# EAGLE design mainboard-augmented-thermostat-v1 (EAGLE 7.5.0)
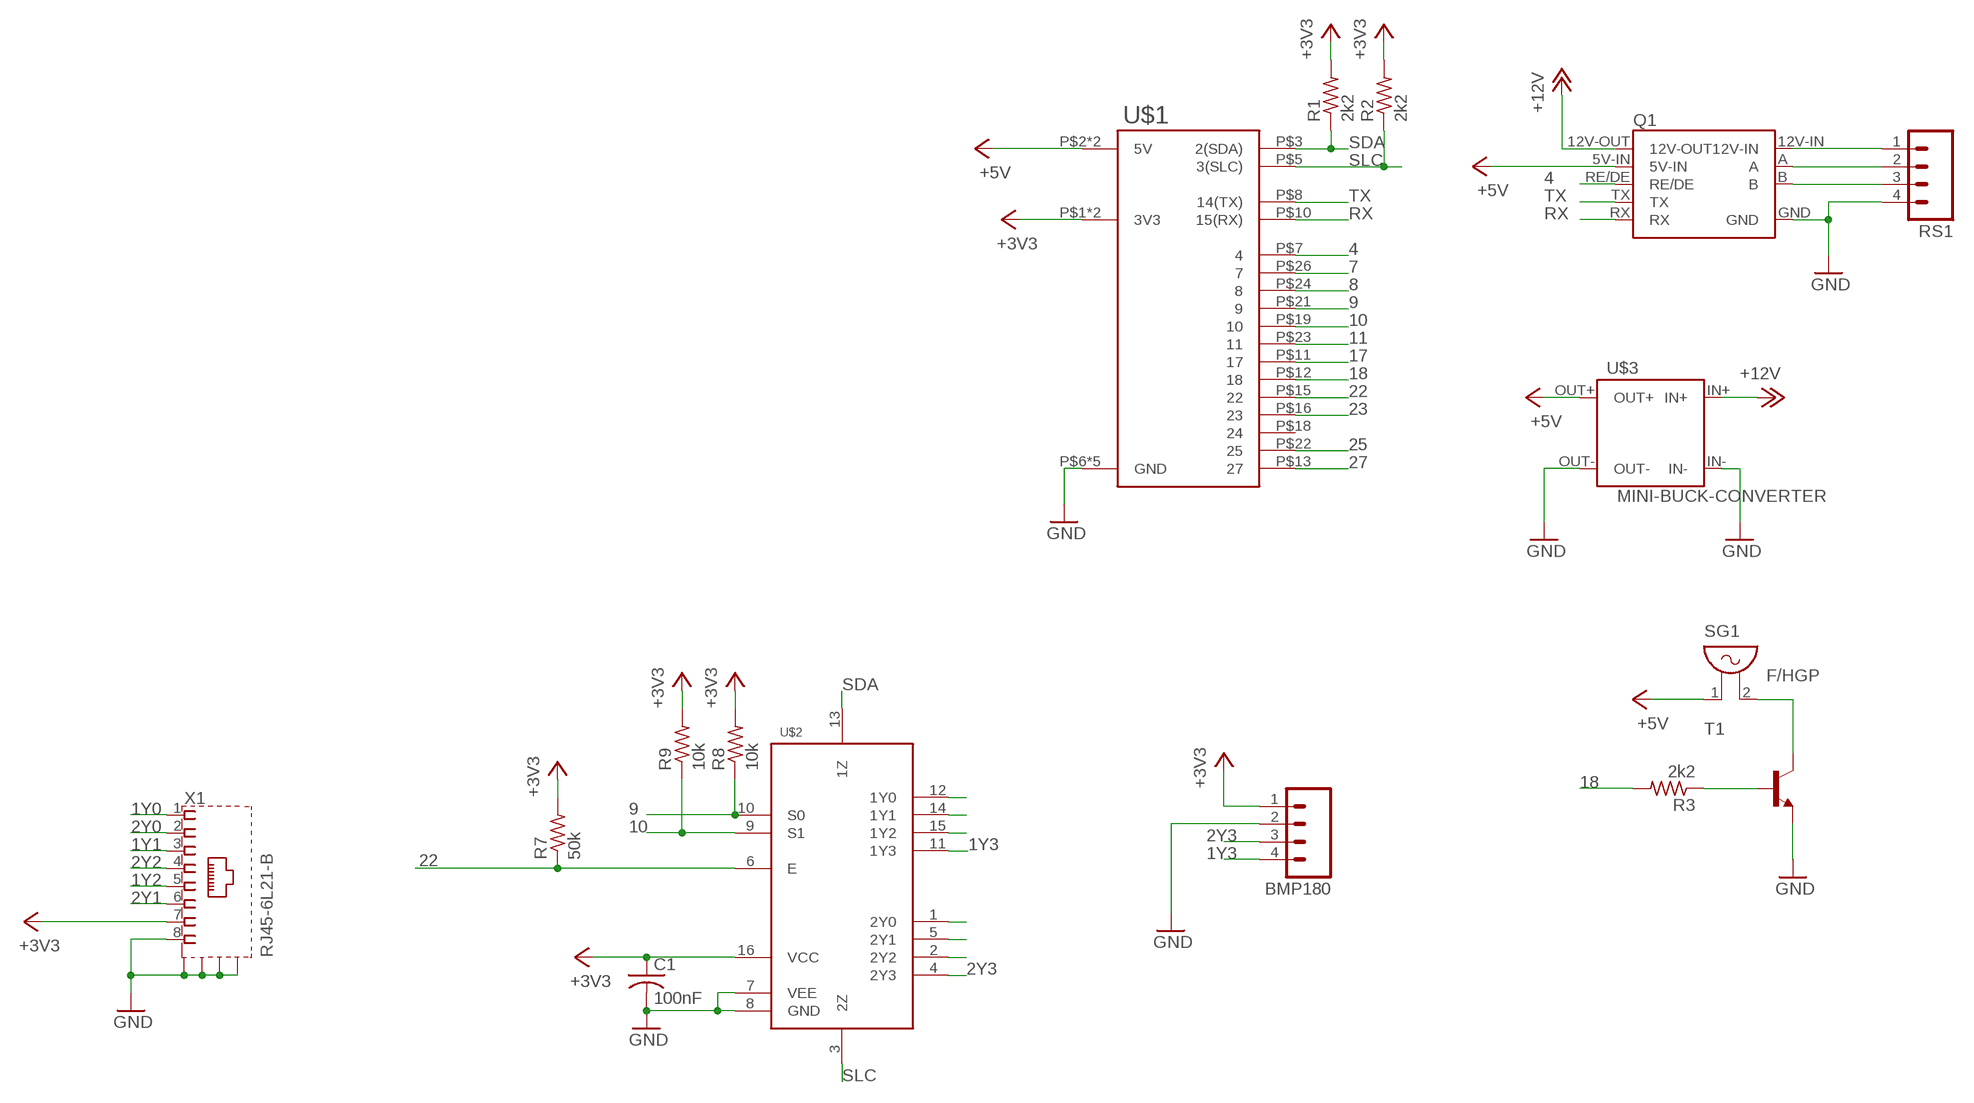
[diagram p0: schematic, sheet 1]

## Parts
BMP180  M04  [04P]
C1  100nF  C-USC0603K  [C0603K]
Q1  RS485-ADAPTER0.05-CONNECTOR  [RS485-ADAPTOR-05]
R1  2k2  R-US_R0603  [R0603]
R2  2k2  R-US_R0603  [R0603]
R3  2k2  R-US_R0603  [R0603]
R7  50k  R-US_R0603  [R0603]
R8  10k  R-US_R0603  [R0603]
R9  10k  R-US_R0603  [R0603]
RS1  M04  [04P]
SG1  F/HGP  [F/HGP]
T1  BC808-NPN-SOT23-BEC  [SOT23-BEC]
U$1  RASPI-GPIO  [RASPI-GPIO-1]
U$2  74HC4052SO-16  [SO16]
U$3  MINI-BUCK-CONVERTER  [MINI-BUCK-CONVERTER]
X1  RJ45-6L21-B  [RJ45-SHIELD1]

## Nets
1Y0: U$2.12(1Y0) X1.1
1Y1: U$2.14(1Y1) X1.3
1Y2: U$2.15(1Y2) X1.5
1Y3: BMP180.4 U$2.11(1Y3)
2Y0: U$2.1(2Y0) X1.2
2Y1: U$2.5(2Y1) X1.6
2Y2: U$2.2(2Y2) X1.4
2Y3: BMP180.3 U$2.4(2Y3)
4: Q1.RE/DE U$1.P$7
7: U$1.P$26
8: U$1.P$24
9: R8.1 U$1.P$21 U$2.10(S0)
10: R9.1 U$1.P$19 U$2.9(S1)
11: U$1.P$23
17: U$1.P$11
18: R3.2 U$1.P$12
22: R7.1 U$1.P$15 U$2.6(E)
23: U$1.P$16
25: U$1.P$22
27: U$1.P$13
+3V3: BMP180.1 C1.1 R1.2 R2.2 R7.2 R8.2 R9.2 U$1.P$1(3V3) U$1.P$17(3V3) U$2.16(VCC) X1.7
+5V: Q1.5V-IN SG1.1 U$1.P$2(5V) U$1.P$4(5V) U$3.OUT+
+12V: Q1.12V-OUT U$3.IN+
GND: BMP180.2 C1.2 Q1.GND RS1.4 T1.E U$1.P$6(GND) U$1.P$9(GND) U$1.P$14(GND) U$1.P$20(GND) U$1.P$25(GND) U$2.7(VEE) U$2.8(GND) U$3.IN- U$3.OUT- X1.8 X1.S1(S) X1.S2(S) X1.S3(S) X1.S4(S)
N$1: R3.1 T1.B
N$2: SG1.2 T1.C
RS-12V: Q1.12V-IN RS1.1
RS-A: Q1.A RS1.2
RS-B: Q1.B RS1.3
RX: Q1.RX U$1.P$10(15(RX))
SDA: R1.1 U$1.P$3(2(SDA)) U$2.13(1Z)
SLC: R2.1 U$1.P$5(3(SLC)) U$2.3(2Z)
TX: Q1.TX U$1.P$8(14(TX))
Unconnected: U$1.P$18

## Library data of the parts
BMP180 RS1 = con-amp-quick:M04: AMP QUICK CONNECTOR; OC_FARNELL: unknown; OC_NEWARK: unknown
C1 = adafruit:C-US: CAPACITOR, American symbol
Q1 = serge:RS485-ADAPTER
R1-R3 R7-R9 = adafruit:R-US_: RESISTOR, American symbol
SG1 = buzzer:F/HGP: BUZZER Source: Buerklin; OC_FARNELL: unknown; OC_NEWARK: unknown
T1 = transistor:*-NPN-: NPN Transistror BF959 corrected 2008.03.06
U$1 = serge:RASPI-GPIO
U$2 = serge:74HC4052
U$3 = serge:MINI-BUCK-CONVERTER
X1 = con-tycoelectronics:RJ45*2: RJ45 Low Profile Shield Type 2 For all RJ45 L, LC, LCT and X Series Models Source: www.tycoelectronics.com .. ENG_DS_1654001_1099_RJ_L_0507.pdf; OC_FARNELL: unknown; OC_NEWARK: unknown

## Board
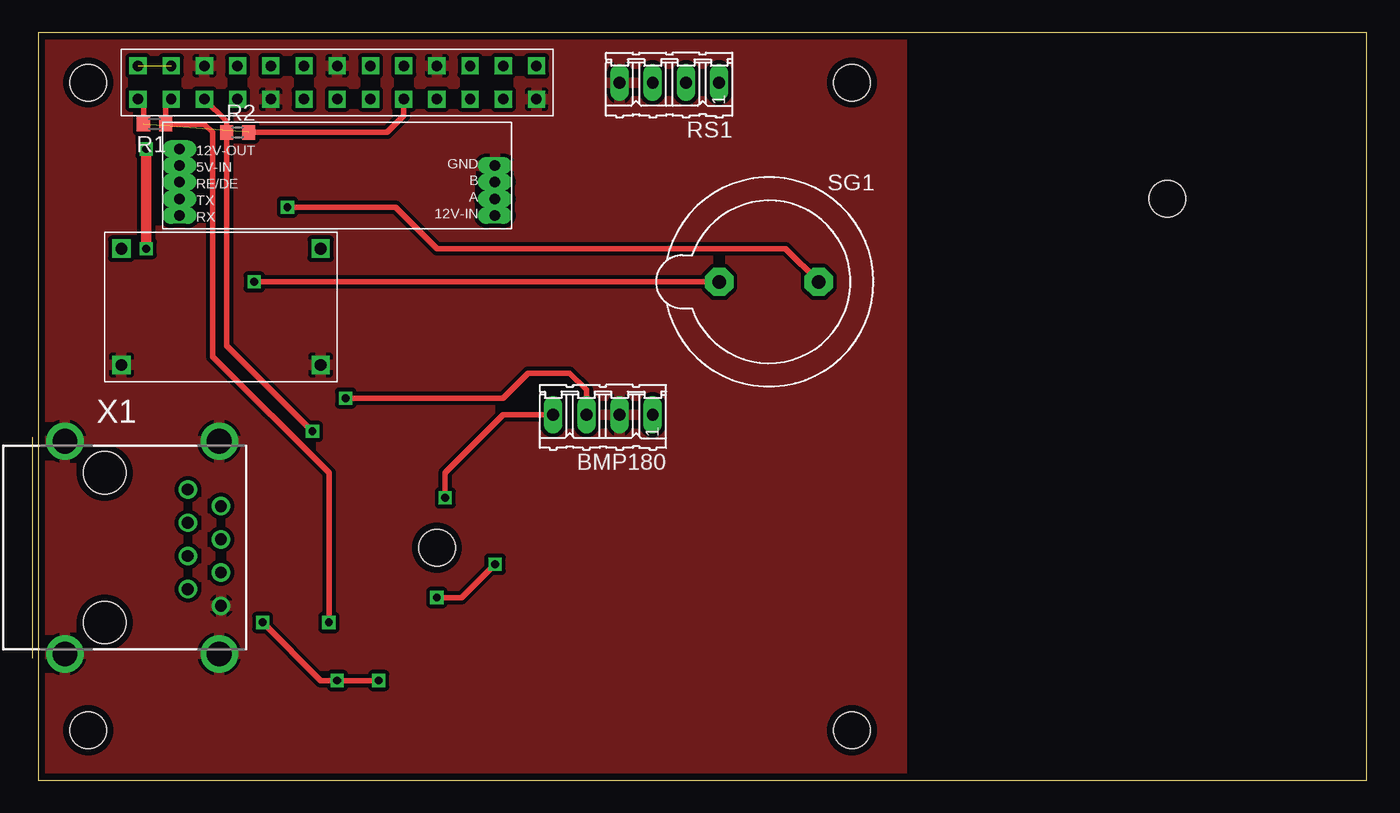
[diagram p1: board, top side]
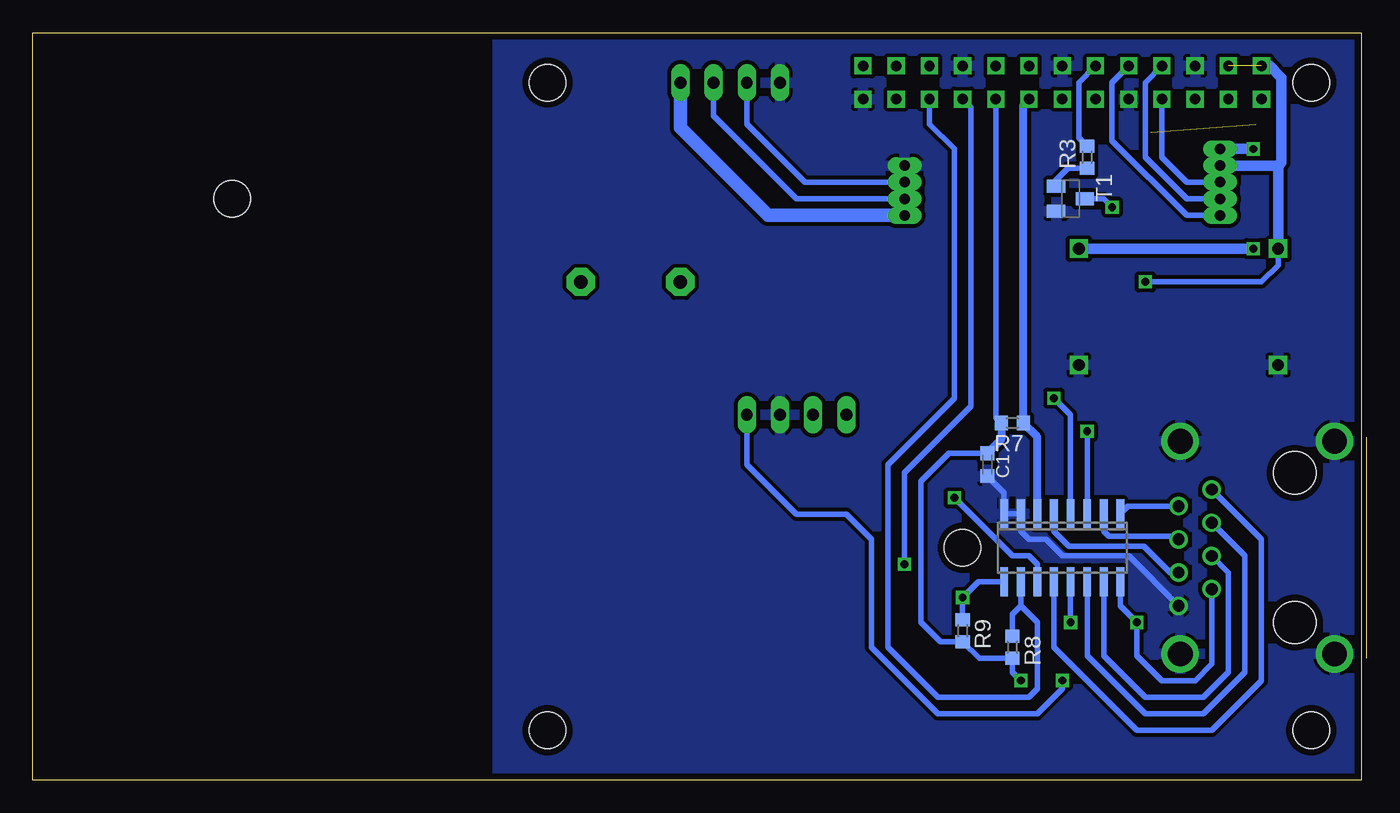
[diagram p2: board, bottom side, seen from below]

Size 101.6 x 57.15 mm. Coordinates in mm from the lower left corner, seen from the top.
Outline: 0,0 101.6,0 101.6,57.15 0,57.15 0,0
Copper layers (1*16): Top 0.035mm / dielectric 1.5mm / Bottom 0.035mm
Design rules "default *": minimum track width 10mil, minimum drill 24mil, track to track 12mil, track to pad 12mil, pad to pad 12mil, via to via 12mil, smd to smd 8mil, copper to edge 20mil, drill to drill 8mil, minimum pad ring 10mil, minimum via ring 8mil, stop-mask expansion 4mil, vias tented up to drill 0mil, thermal gap 10mil
Holes 2.8 mm at 30.48,17.78 86.36,44.45 3.81,3.81 3.81,53.34 62.23,53.34 62.23,3.81

### Footprints (pad centres in the part's own frame; a part is rotated, then mirrored left to right if it is on the bottom)
04P = drill 0.914 long: 1 -3.81,0; 2 -1.27,0; 3 1.27,0; 4 3.81,0
C0603K = smd 1.05 x 1.08: 1 -0.875,0; 2 0.875,0
RS485-ADAPTOR-05 = drill 0.8 pad 1.016 long: 5V-IN -11.43,1.27; 12V-IN 12.7,-2.54; 12V-OUT -11.43,2.54; A 12.7,-1.27; B 12.7,0; GND 12.7,1.27; RE/DE -11.43,0; RX -11.43,-2.54; TX -11.43,-1.27
R0603 = smd 1 x 1.1: 1 -0.85,0; 2 0.85,0
F/HGP = drill 1.016 pad 2.159 octagon: 1 -3.81,0; 2 3.81,0
SOT23-BEC = smd 1 x 1.4: B -0.95,-1.1; C 0,1.1; E 0.95,-1.1
RASPI-GPIO-1 = drill 0.8 square: P$1 0,0; P$2 2.54,0; P$3 0,-2.54; P$4 2.54,-2.54; P$5 0,-5.08; P$6 2.54,-5.08; P$7 0,-7.62; P$8 2.54,-7.62; P$9 0,-10.16; P$10 2.54,-10.16; P$11 0,-12.7; P$12 2.54,-12.7; P$13 0,-15.24; P$14 2.54,-15.24; P$15 0,-17.78; P$16 2.54,-17.78; P$17 0,-20.32; P$18 2.54,-20.32; P$19 0,-22.86; P$20 2.54,-22.86; P$21 0,-25.4; P$22 2.54,-25.4; P$23 0,-27.94; P$24 2.54,-27.94; P$25 0,-30.48; P$26 2.54,-30.48
SO16 = smd 0.6 x 2.2: 1 -4.445,-2.6; 2 -3.175,-2.6; 3 -1.905,-2.6; 4 -0.635,-2.6; 5 0.635,-2.6; 6 1.905,-2.6; 7 3.175,-2.6; 8 4.445,-2.6; 9 4.445,2.6; 10 3.175,2.6; 11 1.905,2.6; 12 0.635,2.6; 13 -0.635,2.6; 14 -1.905,2.6; 15 -3.175,2.6; 16 -4.445,2.6
MINI-BUCK-CONVERTER = drill 0.9 square: IN+ 10.16,1.27; IN- 1.27,1.27; OUT+ 10.16,16.51; OUT- 1.27,16.51
RJ45-SHIELD1 = drill 0.9 pad 1.4: 1 -4.445,6.35; 2 -3.175,8.89; 3 -1.905,6.35; 4 -0.635,8.89; 5 0.635,6.35; 6 1.905,8.89; 7 3.175,6.35; 8 4.445,8.89 | drill 1.9 pad 2.5: S1 -8.128,-3.048; S2 8.128,-3.048; S3 -8.128,8.76; S4 8.128,8.76 | hole 3.251: -5.715,0; 5.715,0

### Placement (x,y rotation side)
BMP180  43.18,27.94 180 top
C1  28.57,24.13 270 bottom
Q1  22.23,45.72 0 top
R1  8.89,50.16 180 top
R2  15.24,49.53 0 top
R3  20.95,47.62 90 bottom
R7  26.67,27.3 180 bottom
R8  26.67,10.16 270 bottom
R9  30.48,11.43 270 bottom
RS1  48.26,53.34 180 top
SG1  55.88,38.1 0 top
T1  22.23,44.45 270 bottom
U$1  7.62,52.07 90 top
U$2  22.86,17.78 180 bottom
U$3  22.86,30.48 90 top
X1  5.08,17.78 270 top

### Tracks (layer width: path | path; a pad name or v marks a point on that pad's centre or on a via)
1Y0
  Bottom 0.406: X1.1 7.62,18.41 7.62,7.62 11.43,3.81 17.14,3.81 23.5,10.16 U$2.12
1Y1
  Bottom 0.406: X1.3 8.89,17.14 8.89,8.26 12.06,5.08 16.51,5.08 20.95,9.53 U$2.14
1Y2
  Bottom 0.406: X1.5 10.16,15.88 10.16,8.26 12.06,6.35 16.51,6.35 19.68,9.53 U$2.15
1Y3  (via drill 0.6)
  Top 0.406: v31.11,21.59 31.11,23.5 35.56,27.94 BMP180.4
  Bottom 0.406: U$2.11 24.77,16.51 25.4,17.14 26.67,17.14 v31.11,21.59
2Y0
  Bottom 0.406: X1.2 17.84,20.95 U$2.1
2Y1
  Bottom 0.406: X1.6 14.61,15.88 16.64,17.91 22.35,17.91 23.5,19.05 U$2.5
2Y2
  Bottom 0.406: U$2.2 19.68,19.05 19.3,18.67 14.22,18.67 X1.4
2Y3  (via drill 0.6)
  Top 0.406: v23.5,29.21 35.56,29.21 37.47,31.11 40.64,31.11 41.91,29.84 BMP180.3
  Bottom 0.406: U$2.4 22.23,27.94 v23.5,29.21
4
  Bottom 0.406: U$1.P$7 15.24,47.62 13.34,45.72 Q1.RE/DE
9
  Bottom 0.406: U$2.10 26.04,13.34 | 26.04,13.34 24.77,12.06 24.77,6.99 25.4,6.35 32.38,6.35 36.2,10.16 36.2,24.13 31.11,29.21 31.11,48.26 33.02,50.16 U$1.P$21 | R8.1 26.67,12.7 26.04,13.34
10  (via drill 0.6)
  Top 0.406: v30.48,13.97 32.38,13.97 v34.92,16.51
  Bottom 0.406: U$2.9 29.27,15.18 v30.48,13.97 R9.1 | v34.92,16.51 34.92,23.5 29.84,28.57 29.84,51.44 U$1.P$19
18
  Bottom 0.406: U$1.P$12 21.59,53.34 21.59,49.11 R3.2
22
  Bottom 0.61: U$2.6 24.77,26.25 R7.1 25.82,51.65 U$1.P$15
+3V3  (via drill 0.6)  (1 unrouted)
  Top 0.406: R1.2 8.04,51.65 U$1.P$1 | R2.2 26.67,49.53 27.94,50.8 U$1.P$17 | v26.04,7.62 v22.86,7.62 21.59,7.62 v17.14,12.06
  Bottom 0.406: U$2.16 18.41,13.34 v17.14,12.06 17.14,9.53 15.24,7.62 12.7,7.62 11.43,8.89 X1.7 | C1.1 31.51,25 33.66,22.86 33.66,12.06 32.17,10.58 R9.2 29.21,9.31 R8.2 26.67,8.26 v26.04,7.62 | U$1.P$17 27.94,27.73 R7.2 | BMP180.1 46.99,24.13 43.18,20.32 39.37,20.32 37.47,18.41 37.47,10.16 32.38,5.08 24.77,5.08 22.86,6.99 v22.86,7.62
  Bottom 0.61: R7.2 27.52,26.06 C1.1
+5V  (via drill 0.6)  (1 unrouted)
  Top 0.406: SG1.1 v16.51,38.1
  Bottom 0.406: v16.51,38.1 7.62,38.1 6.35,39.37 U$3.OUT+
  Bottom 0.813: Q1.5V-IN 6.35,46.99 | U$3.OUT+ 6.35,46.99 | U$1.P$2 6.99,54.61 6.1,53.72 6.1,47.24 6.35,46.99
+12V  (via drill 0.6)
  Top 0.813: v8.26,48.26 v8.26,40.64
  Bottom 0.813: Q1.12V-OUT v8.26,48.26 | v8.26,40.64 U$3.IN+
GND
  Bottom 0.406: C1.2 27.3,21.98 U$2.8 U$2.7 26.04,19.05 25.4,18.41 24.13,18.41 22.86,17.14 17.78,17.14 X1.8
  pour Bottom: 0,57.15 66.04,57.15 66.04,0 0,0
  pour Top: 0,57.15 66.04,57.15 66.04,0 0,0
N$1
  Bottom 0.406: R3.1 22.44,46.77 23.5,45.72 23.5,45.57 T1.B
N$2  (via drill 0.6)
  Top 0.406: v19.05,43.81 27.3,43.81 30.48,40.64 57.15,40.64 SG1.2
  Bottom 0.406: T1.C 19.68,44.45 v19.05,43.81
RS-12V
  Bottom 1.016: RS1.1 52.07,49.9 45.35,43.18 Q1.12V-IN
RS-A
  Bottom 0.406: Q1.A 43.18,44.45 49.53,50.8 RS1.2
RS-B
  Bottom 0.406: Q1.B 42.55,45.72 46.99,50.16 RS1.3
RX
  Bottom 0.406: U$1.P$10 19.05,53.34 19.05,48.9 13.34,43.18 Q1.RX
SDA  (via drill 0.6)
  Top 0.406: U$1.P$3 9.74,51.65 R1.1 12.7,50.16 13.34,49.53 13.34,32.38 22.23,23.5 v22.23,12.06
  Bottom 0.406: v22.23,12.06 U$2.13
SLC  (via drill 0.6)
  Top 0.406: U$1.P$5 14.39,50.38 R2.1 14.39,33.23 v20.95,26.67
  Bottom 0.406: v20.95,26.67 U$2.3
TX
  Bottom 0.406: U$1.P$8 16.51,53.34 16.51,47.62 13.34,44.45 Q1.TX